# Altium schematic sheet IO.SchDoc
size A4; SheetNumber: 3; SheetTotal: 6
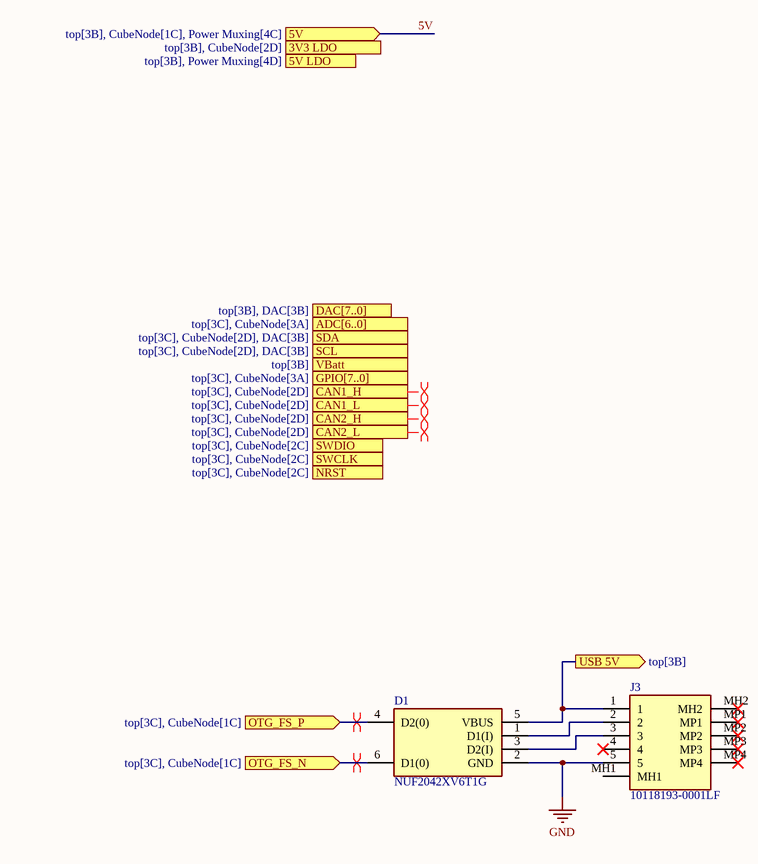
[diagram p0: IO.SchDoc]

## Parts
D1  NUF2042XV6T1G  [SOTFL50P160X60-6N]
J3  10118193-0001LF  [101181930001LF]

## Ports
3V3 LDO (in, see top[3B], CubeNode[2D]), 5V (in, see top[3B], CubeNode[1C], Power Muxing[4C]), 5V LDO (in, see top[3B], Power Muxing[4D]), ADC[6..0] (in, see top[3C], CubeNode[3A]), CAN1_H (in, see top[3C], CubeNode[2D]), CAN1_L (in, see top[3C], CubeNode[2D]), CAN2_H (in, see top[3C], CubeNode[2D]), CAN2_L (in, see top[3C], CubeNode[2D]), DAC[7..0] (in, see top[3B], DAC[3B]), GPIO[7..0] (in, see top[3C], CubeNode[3A]), NRST (in, see top[3C], CubeNode[2C]), OTG_FS_N (in, see top[3C], CubeNode[1C]), OTG_FS_P (in, see top[3C], CubeNode[1C]), SCL (in, see top[3C], CubeNode[2D], DAC[3B]), SDA (in, see top[3C], CubeNode[2D], DAC[3B]), SWCLK (in, see top[3C], CubeNode[2C]), SWDIO (in, see top[3C], CubeNode[2C]), USB 5V (out, see top[3B]), VBatt (out, see top[3B])

## Nets
GND: D1.2(GND) J3.5
5V: port 5V
OTG_FS_N: D1.6(D1(0)) ; port OTG_FS_N
OTG_FS_P: D1.4(D2(0)) ; port OTG_FS_P
USB 5V: D1.5(VBUS) J3.1 ; port USB 5V
NetD1_1: D1.1(D1(I)) J3.2
NetD1_3: D1.3(D2(I)) J3.3

Not connected (* = marked no-connect by the designer): J3 4* MH1 MH2* MP1* MP2* MP3* MP4*

## Layout directives
differential pair: CAN1_H, CAN1_L, CAN2_H, CAN2_L, OTG_FS_N, OTG_FS_P

## Library data of the parts
D1 = NUF2042XV6T1G: Diode; Manufacturer_Name: onsemi; Datasheet Link: https://www.onsemi.com/pub/Collateral/NUF2030XV6-D.PDF; Height: 0.6mm; Manufacturer_Part_Number: NUF2042XV6T1G; Mouser Part Number: 863-NUF2042XV6T1G; Mouser Price/Stock: https://www.mouser.co.uk/ProductDetail/onsemi/NUF2042XV6T1G?qs=ZXBb0xZ9WeAV3XcAwewBSw%3D%3D; Arrow Part Number: NUF2042XV6T1G; Arrow Price/Stock: https://www.arrow.com/en/products/nuf2042xv6t1g/on-semiconductor?region=europe
J3 = 10118193-0001LF: Connector; Manufacturer_Name: Amphenol Communications Solutions; Datasheet Link: https://cdn.amphenol-cs.com/media/wysiwyg/files/drawing/10118193.pdf; Height: 3.3mm; Manufacturer_Part_Number: 10118193-0001LF; Arrow Part Number: 10118193-0001LF; Arrow Price/Stock: https://www.arrow.com/en/products/10118193-0001lf/amphenol-fci?utm_currency=USD&region=europe